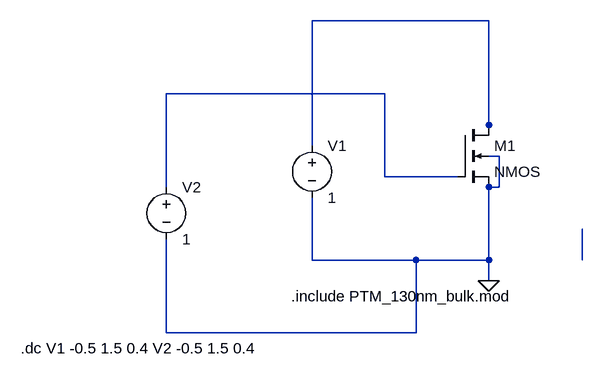
[diagram p0: schematic ptm130_W20uL1u.asc]
ptm130_W20uL1u.asc, the LTspice schematic file:
Version 4
SHEET 1 916 680
WIRE 416 -32 144 -32
WIRE 256 80 -80 80
WIRE 416 128 416 -32
WIRE 416 144 416 128
WIRE 144 160 144 -32
WIRE 432 176 416 176
WIRE 256 208 256 80
WIRE 368 208 256 208
WIRE -80 224 -80 80
WIRE 432 224 432 176
WIRE 432 224 416 224
WIRE 144 336 144 240
WIRE 304 336 144 336
WIRE 416 336 416 224
WIRE 416 336 304 336
WIRE 560 336 560 288
WIRE 416 368 416 336
WIRE -80 448 -80 304
WIRE 304 448 304 336
WIRE 304 448 -80 448
FLAG 416 368 0
SYMBOL voltage 144 144 R0
WINDOW 123 0 0 Left 2
WINDOW 39 0 0 Left 2
SYMATTR InstName V1
SYMATTR Value 1
SYMBOL NMOS4 368 128 R0
SYMATTR InstName M1
SYMATTR Value2 l=1e-6 w=20e-6
SYMBOL voltage -80 208 R0
WINDOW 123 0 0 Left 2
WINDOW 39 0 0 Left 2
SYMATTR InstName V2
SYMATTR Value 1
TEXT 112 392 Left 2 !.include PTM_130nm_bulk.mod
TEXT -304 472 Left 2 !.dc V1 -0.5 1.5 0.4 V2 -0.5 1.5 0.4

The netlist it stands for:
* ptm130_W20uL1u.asc
V1 N001 0 1
M1 N001 N002 0 0 NMOS l=1e-6 w=20e-6
V2 N002 0 1
.model NMOS NMOS
.model PMOS PMOS
.lib standard.mos
.include PTM_130nm_bulk.mod
.dc V1 -0.5 1.5 0.4 V2 -0.5 1.5 0.4
.backanno
.end